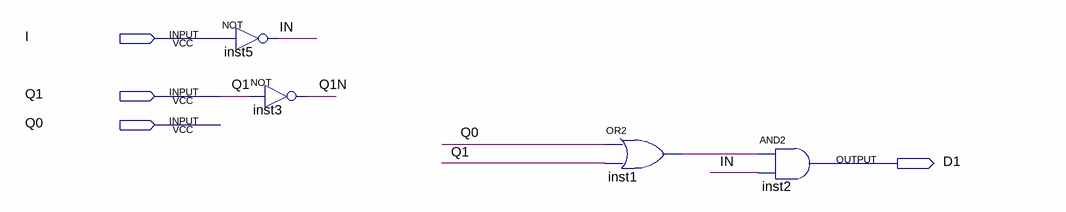
[diagram p0: schematic sheet]
// Quartus schematic D1.bdf as structural Verilog: 4 symbols, 4 pins
module D1 (
  input  I,
  input  Q1,
  input  Q0,
  output D1
);

  wire IN, inst1_out, Q1N;

  not inst5 (IN, I);
  not inst3 (Q1N, Q1);
  or inst1 (inst1_out, Q0, Q1);
  and inst2 (D1, inst1_out, IN);
endmodule
